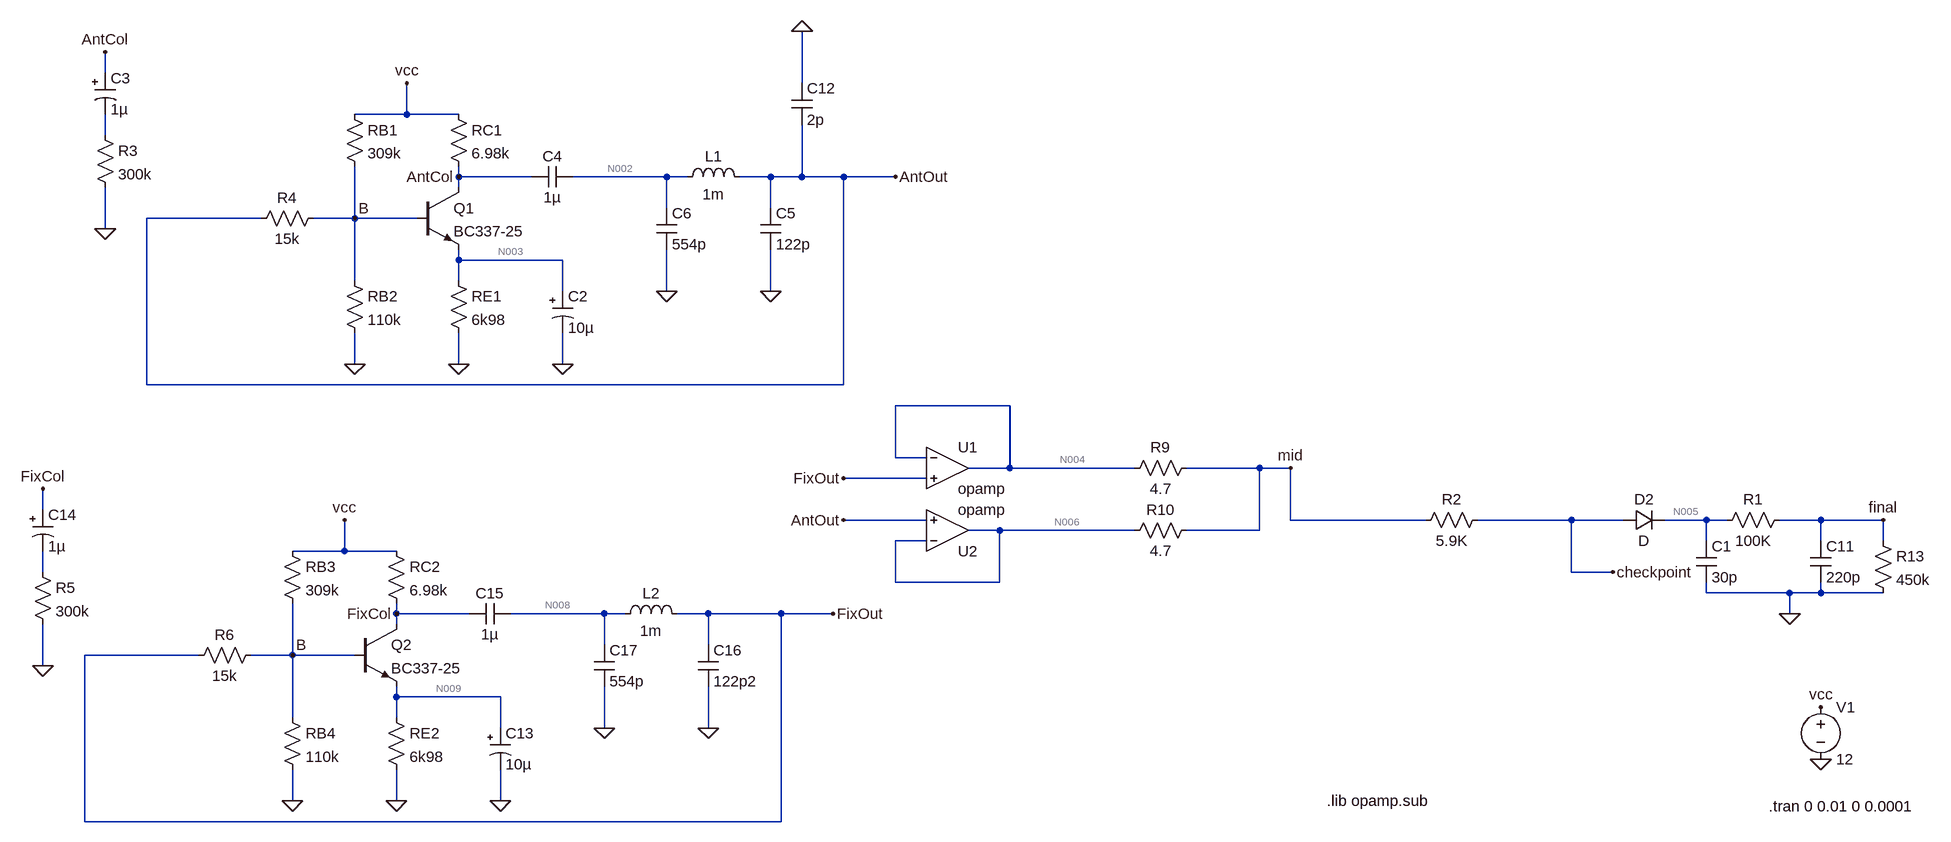
[diagram p0: schematic improvedHomeBuildMixer2MedOscilatorAtHome.asc]
improvedHomeBuildMixer2MedOscilatorAtHome.asc, the LTspice schematic file:
Version 4
SHEET 1 992 1124
WIRE -3376 -128 -3376 -160
WIRE -2304 -112 -2304 -192
WIRE -2912 -64 -2912 -112
WIRE -2912 -64 -2992 -64
WIRE -2832 -64 -2912 -64
WIRE -3376 -32 -3376 -64
WIRE -2832 32 -2832 16
WIRE -2720 32 -2832 32
WIRE -2512 32 -2656 32
WIRE -2480 32 -2512 32
WIRE -2352 32 -2400 32
WIRE -2304 32 -2304 -48
WIRE -2304 32 -2352 32
WIRE -2240 32 -2304 32
WIRE -2160 32 -2240 32
WIRE -2832 48 -2832 32
WIRE -2512 80 -2512 32
WIRE -2352 80 -2352 32
WIRE -3136 96 -3312 96
WIRE -2992 96 -2992 16
WIRE -2992 96 -3056 96
WIRE -2896 96 -2992 96
WIRE -3376 112 -3376 48
WIRE -2832 160 -2832 144
WIRE -2672 160 -2832 160
WIRE -2992 192 -2992 96
WIRE -2832 192 -2832 160
WIRE -2672 208 -2672 160
WIRE -2512 208 -2512 144
WIRE -2352 208 -2352 144
WIRE -2992 320 -2992 272
WIRE -2832 320 -2832 272
WIRE -2672 320 -2672 272
WIRE -3312 352 -3312 96
WIRE -2240 352 -2240 32
WIRE -2240 352 -3312 352
WIRE -1984 384 -2160 384
WIRE -2160 464 -2160 384
WIRE -2112 464 -2160 464
WIRE -1984 480 -1984 384
WIRE -1984 480 -2048 480
WIRE -1792 480 -1984 480
WIRE -1600 480 -1712 480
WIRE -1552 480 -1600 480
WIRE -2112 496 -2240 496
WIRE -3472 544 -3472 512
WIRE -2112 560 -2240 560
WIRE -1552 560 -1552 480
WIRE -1344 560 -1552 560
WIRE -1120 560 -1264 560
WIRE -1040 560 -1120 560
WIRE -912 560 -976 560
WIRE -880 560 -912 560
WIRE -736 560 -800 560
WIRE -640 560 -736 560
WIRE -2000 576 -2048 576
WIRE -1792 576 -2000 576
WIRE -1600 576 -1600 480
WIRE -1600 576 -1712 576
WIRE -2112 592 -2160 592
WIRE -912 592 -912 560
WIRE -736 592 -736 560
WIRE -640 592 -640 560
WIRE -3008 608 -3008 560
WIRE -3008 608 -3088 608
WIRE -2928 608 -3008 608
WIRE -3472 640 -3472 608
WIRE -1120 640 -1120 560
WIRE -1056 640 -1120 640
WIRE -2160 656 -2160 592
WIRE -2000 656 -2000 576
WIRE -2000 656 -2160 656
WIRE -912 672 -912 656
WIRE -784 672 -912 672
WIRE -736 672 -736 656
WIRE -736 672 -784 672
WIRE -640 672 -736 672
WIRE -2928 704 -2928 688
WIRE -2816 704 -2928 704
WIRE -2608 704 -2752 704
WIRE -2576 704 -2608 704
WIRE -2448 704 -2496 704
WIRE -2336 704 -2448 704
WIRE -2256 704 -2336 704
WIRE -784 704 -784 672
WIRE -2928 720 -2928 704
WIRE -2608 752 -2608 704
WIRE -2448 752 -2448 704
WIRE -3232 768 -3408 768
WIRE -3088 768 -3088 688
WIRE -3088 768 -3152 768
WIRE -2992 768 -3088 768
WIRE -3472 784 -3472 720
WIRE -2928 832 -2928 816
WIRE -2768 832 -2928 832
WIRE -3088 864 -3088 768
WIRE -2928 864 -2928 832
WIRE -2768 880 -2768 832
WIRE -2608 880 -2608 816
WIRE -2448 880 -2448 816
WIRE -3088 992 -3088 944
WIRE -2928 992 -2928 944
WIRE -2768 992 -2768 944
WIRE -3408 1024 -3408 768
WIRE -2336 1024 -2336 704
WIRE -2336 1024 -3408 1024
FLAG -1552 480 mid
FLAG -1056 640 checkpoint
FLAG -784 704 0
FLAG -640 560 final
FLAG -2912 -112 vcc
FLAG -736 848 vcc
FLAG -736 928 0
FLAG -2672 320 0
FLAG -2832 320 0
FLAG -2992 320 0
FLAG -2832 32 AntCol
FLAG -3376 112 0
FLAG -2992 96 B
FLAG -2352 208 0
FLAG -2512 208 0
FLAG -3376 -160 AntCol
FLAG -2160 32 AntOut
FLAG -2304 -192 0
FLAG -3008 560 vcc
FLAG -2768 992 0
FLAG -2928 992 0
FLAG -3088 992 0
FLAG -2928 704 FixCol
FLAG -3472 784 0
FLAG -3088 768 B
FLAG -2448 880 0
FLAG -2608 880 0
FLAG -3472 512 FixCol
FLAG -2256 704 FixOut
FLAG -2240 496 FixOut
FLAG -2240 560 AntOut
SYMBOL res -1696 464 R90
WINDOW 0 0 56 VBottom 2
WINDOW 3 32 56 VTop 2
SYMATTR InstName R9
SYMATTR Value 4.7
SYMBOL res -1696 560 R90
WINDOW 0 0 56 VBottom 2
WINDOW 3 32 56 VTop 2
SYMATTR InstName R10
SYMATTR Value 4.7
SYMBOL diode -1040 576 R270
WINDOW 0 32 32 VTop 2
WINDOW 3 0 32 VBottom 2
SYMATTR InstName D2
SYMBOL cap -752 592 R0
SYMATTR InstName C11
SYMATTR Value 220p
SYMBOL res -656 576 R0
SYMATTR InstName R13
SYMATTR Value 450k
SYMBOL res -1248 544 R90
WINDOW 0 0 56 VBottom 2
WINDOW 3 32 56 VTop 2
SYMATTR InstName R2
SYMATTR Value 5.9K
SYMBOL res -784 544 R90
WINDOW 0 0 56 VBottom 2
WINDOW 3 32 56 VTop 2
SYMATTR InstName R1
SYMATTR Value 100K
SYMBOL cap -928 592 R0
SYMATTR InstName C1
SYMATTR Value 30p
SYMBOL res -3008 -80 R0
SYMATTR InstName RB1
SYMATTR Value 309k
SYMBOL res -2848 -80 R0
SYMATTR InstName RC1
SYMATTR Value 6.98k
SYMBOL res -2848 176 R0
SYMATTR InstName RE1
SYMATTR Value 6k98
SYMBOL res -3008 176 R0
SYMATTR InstName RB2
SYMATTR Value 110k
SYMBOL polcap -2688 208 R0
SYMATTR InstName C2
SYMATTR Value 10µ
SYMBOL voltage -736 832 R0
WINDOW 123 0 0 Left 0
WINDOW 39 0 0 Left 0
SYMATTR InstName V1
SYMATTR Value 12
SYMBOL polcap -3392 -128 R0
SYMATTR InstName C3
SYMATTR Value 1µ
SYMBOL res -3392 -48 R0
SYMATTR InstName R3
SYMATTR Value 300k
SYMBOL cap -2656 16 R90
WINDOW 0 0 32 VBottom 2
WINDOW 3 32 32 VTop 2
SYMATTR InstName C4
SYMATTR Value 1µ
SYMBOL npn -2896 48 R0
SYMATTR InstName Q1
SYMATTR Value BC337-25
SYMBOL res -3040 80 R90
WINDOW 0 0 56 VBottom 2
WINDOW 3 32 56 VTop 2
SYMATTR InstName R4
SYMATTR Value 15k
SYMBOL ind -2384 48 M270
WINDOW 0 32 56 VTop 2
WINDOW 3 5 56 VBottom 2
SYMATTR InstName L1
SYMATTR Value 1m
SYMBOL cap -2368 80 R0
SYMATTR InstName C5
SYMATTR Value 122p
SYMBOL cap -2528 80 R0
SYMATTR InstName C6
SYMATTR Value 554p
SYMBOL cap -2320 -112 R0
SYMATTR InstName C12
SYMATTR Value 2p
SYMBOL res -3104 592 R0
SYMATTR InstName RB3
SYMATTR Value 309k
SYMBOL res -2944 592 R0
SYMATTR InstName RC2
SYMATTR Value 6.98k
SYMBOL res -2944 848 R0
SYMATTR InstName RE2
SYMATTR Value 6k98
SYMBOL res -3104 848 R0
SYMATTR InstName RB4
SYMATTR Value 110k
SYMBOL polcap -2784 880 R0
SYMATTR InstName C13
SYMATTR Value 10µ
SYMBOL polcap -3488 544 R0
SYMATTR InstName C14
SYMATTR Value 1µ
SYMBOL res -3488 624 R0
SYMATTR InstName R5
SYMATTR Value 300k
SYMBOL cap -2752 688 R90
WINDOW 0 0 32 VBottom 2
WINDOW 3 32 32 VTop 2
SYMATTR InstName C15
SYMATTR Value 1µ
SYMBOL npn -2992 720 R0
SYMATTR InstName Q2
SYMATTR Value BC337-25
SYMBOL res -3136 752 R90
WINDOW 0 0 56 VBottom 2
WINDOW 3 32 56 VTop 2
SYMATTR InstName R6
SYMATTR Value 15k
SYMBOL ind -2480 720 M270
WINDOW 0 32 56 VTop 2
WINDOW 3 5 56 VBottom 2
SYMATTR InstName L2
SYMATTR Value 1m
SYMBOL cap -2464 752 R0
SYMATTR InstName C16
SYMATTR Value 122p2
SYMBOL cap -2624 752 R0
SYMATTR InstName C17
SYMATTR Value 554p
SYMBOL OpAmps\\opamp -2080 416 R0
SYMATTR InstName U1
SYMBOL OpAmps\\opamp -2080 640 M180
SYMATTR InstName U2
TEXT -816 1000 Left 2 !.tran 0 0.01 0 0.0001
TEXT -1496 992 Left 2 !.lib opamp.sub

The netlist it stands for:
* improvedHomeBuildMixer2MedOscilatorAtHome.asc
R9 mid N004 4.7
R10 mid N006 4.7
D2 checkpoint N005 D
C11 final 0 220p
R13 final 0 450k
R2 checkpoint mid 5.9K
R1 final N005 100K
C1 N005 0 30p
RB1 vcc B 309k
RC1 vcc AntCol 6.98k
RE1 N003 0 6k98
RB2 B 0 110k
C2 N003 0 10µ
V1 vcc 0 12
C3 AntCol N001 1µ
R3 N001 0 300k
C4 N002 AntCol 1µ
Q1 AntCol B N003 0 BC337-25
R4 B AntOut 15k
L1 AntOut N002 1m
C5 AntOut 0 122p
C6 N002 0 554p
C12 0 AntOut 2p
RB3 vcc B 309k
RC2 vcc FixCol 6.98k
RE2 N009 0 6k98
RB4 B 0 110k
C13 N009 0 10µ
C14 FixCol N007 1µ
R5 N007 0 300k
C15 N008 FixCol 1µ
Q2 FixCol B N009 0 BC337-25
R6 B FixOut 15k
L2 FixOut N008 1m
C16 FixOut 0 122p2
C17 N008 0 554p
XU1 N004 FixOut N004 opamp Aol=100K GBW=10Meg  ; pins invin noninvin out
XU2 N006 AntOut N006 opamp Aol=100K GBW=10Meg  ; pins invin noninvin out
.model D D
.lib standard.dio
.model NPN NPN
.model PNP PNP
.lib standard.bjt
.tran 0 0.01 0 0.0001
.lib opamp.sub
.backanno
.end

* Results of the author's LTspice run, read from the files saved beside the schematic
* Operating Point, zero values left out:
*   V(mid) = 3.049 V
*   V(n004) = 3.049 V
*   V(n006) = 3.049 V
*   V(checkpoint) = 3.022 V
*   V(n005) = 2.507 V
*   V(final) = 2.051 V
*   V(vcc) = 12 V
*   V(b) = 3.049 V
*   V(antcol) = 9.54 V
*   V(n003) = 2.469 V
*   V(n002) = 3.049 V
*   V(antout) = 3.049 V
*   V(fixcol) = 9.54 V
*   V(n009) = 2.469 V
*   V(n008) = 3.049 V
*   V(fixout) = 3.049 V
*   Ic(Q1) = 352.4 µA
*   Ib(Q1) = 1.246 µA
*   Ie(Q1) = -353.7 µA
*   Ic(Q2) = 352.4 µA
*   Ib(Q2) = 1.246 µA
*   Ie(Q2) = -353.7 µA
*   I(D2) = 4.558 µA
*   I(R9) = -2.279 µA
*   I(R10) = -2.279 µA
*   I(R13) = 4.558 µA
*   I(R2) = -4.558 µA
*   I(R1) = -4.558 µA
*   I(Rb1) = 28.97 µA
*   I(Rc1) = 352.4 µA
*   I(Re1) = 353.7 µA
*   I(Rb2) = 27.72 µA
*   I(Rb3) = 28.97 µA
*   I(Rc2) = 352.4 µA
*   I(Re2) = 353.7 µA
*   I(Rb4) = 27.72 µA
*   I(V1) = -762.8 µA
*   Ix(u1:3) = -2.279 µA
*   Ix(u2:3) = -2.279 µA